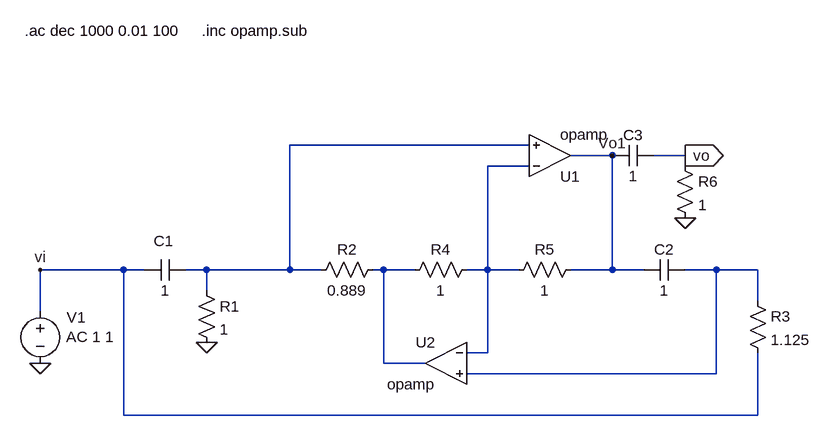
[diagram p0: schematic highpass notch.ASC.asc]
highpass notch.ASC.asc, the LTspice schematic file:
Version 4
SHEET 1 920 680
WIRE 480 -16 112 -16
WIRE 608 0 544 0
WIRE 720 0 672 0
WIRE 480 16 416 16
WIRE 720 16 720 0
WIRE -144 176 -272 176
WIRE -112 176 -144 176
WIRE -16 176 -48 176
WIRE 112 176 112 -16
WIRE 112 176 -16 176
WIRE 160 176 112 176
WIRE 256 176 240 176
WIRE 304 176 256 176
WIRE 416 176 416 16
WIRE 416 176 384 176
WIRE 464 176 416 176
WIRE 608 176 608 0
WIRE 608 176 544 176
WIRE 656 176 608 176
WIRE 768 176 720 176
WIRE 832 176 768 176
WIRE -16 208 -16 176
WIRE 832 224 832 176
WIRE -272 240 -272 176
WIRE 416 304 416 176
WIRE 416 304 384 304
WIRE 256 320 256 176
WIRE 320 320 256 320
WIRE 768 336 768 176
WIRE 768 336 384 336
WIRE -144 400 -144 176
WIRE 832 400 832 304
WIRE 832 400 -144 400
FLAG -272 320 0
FLAG 608 0 Vo1
FLAG -272 176 vi
FLAG -16 288 0
FLAG 720 96 0
FLAG 720 0 vo
IOPIN 720 0 Out
SYMBOL res 144 192 R270
WINDOW 0 32 56 VTop 2
WINDOW 3 0 56 VBottom 2
SYMATTR InstName R2
SYMATTR Value 0.889
SYMBOL res 448 192 R270
WINDOW 0 32 56 VTop 2
WINDOW 3 0 56 VBottom 2
SYMATTR InstName R5
SYMATTR Value 1
SYMBOL res 816 208 R0
SYMATTR InstName R3
SYMATTR Value 1.125
SYMBOL OpAmps\\opamp 512 64 M180
SYMATTR InstName U1
SYMATTR SpiceLine Aol=10000K
SYMATTR SpiceLine2 GBW=1000Meg
SYMBOL OpAmps\\opamp 352 256 M0
SYMATTR InstName U2
SYMATTR SpiceLine Aol=10000K
SYMATTR SpiceLine2 GBW=1000Meg
SYMBOL voltage -272 224 R0
WINDOW 123 40 55 Left 2
WINDOW 39 0 0 Left 0
WINDOW 0 41 25 Left 2
SYMATTR Value2 AC 1 1
SYMATTR InstName V1
SYMATTR Value ""
SYMBOL cap -48 160 R90
WINDOW 0 -13 34 VBottom 2
WINDOW 3 32 32 VTop 2
SYMATTR InstName C1
SYMATTR Value 1
SYMBOL res -32 192 R0
SYMATTR InstName R1
SYMATTR Value 1
SYMBOL res 400 160 R90
WINDOW 0 0 56 VBottom 2
WINDOW 3 32 56 VTop 2
SYMATTR InstName R4
SYMATTR Value 1
SYMBOL cap 720 160 R90
WINDOW 0 0 32 VBottom 2
WINDOW 3 32 32 VTop 2
SYMATTR InstName C2
SYMATTR Value 1
SYMBOL cap 672 -16 R90
WINDOW 0 0 32 VBottom 2
WINDOW 3 32 32 VTop 2
SYMATTR InstName C3
SYMATTR Value 1
SYMBOL res 704 0 R0
SYMATTR InstName R6
SYMATTR Value 1
TEXT -296 -192 Left 2 !.ac dec 1000 0.01 100
TEXT -24 -192 Left 2 !.inc opamp.sub

The netlist it stands for:
* highpass notch.ASC.asc
R2 N001 N003 0.889
R5 N002 Vo1 1
R3 N004 vi 1.125
XU1 N002 N001 Vo1 opamp Aol=10000K GBW=1000Meg  ; pins invin noninvin out
XU2 N002 N004 N003 opamp Aol=10000K GBW=1000Meg  ; pins invin noninvin out
V1 vi 0 AC 1 1
C1 N001 vi 1
R1 N001 0 1
R4 N002 N003 1
C2 N004 Vo1 1
C3 vo Vo1 1
R6 vo 0 1
.ac dec 1000 0.01 100
.inc opamp.sub
.backanno
.end